# Altium schematic sheet isolator_si8662.SchDoc
size A
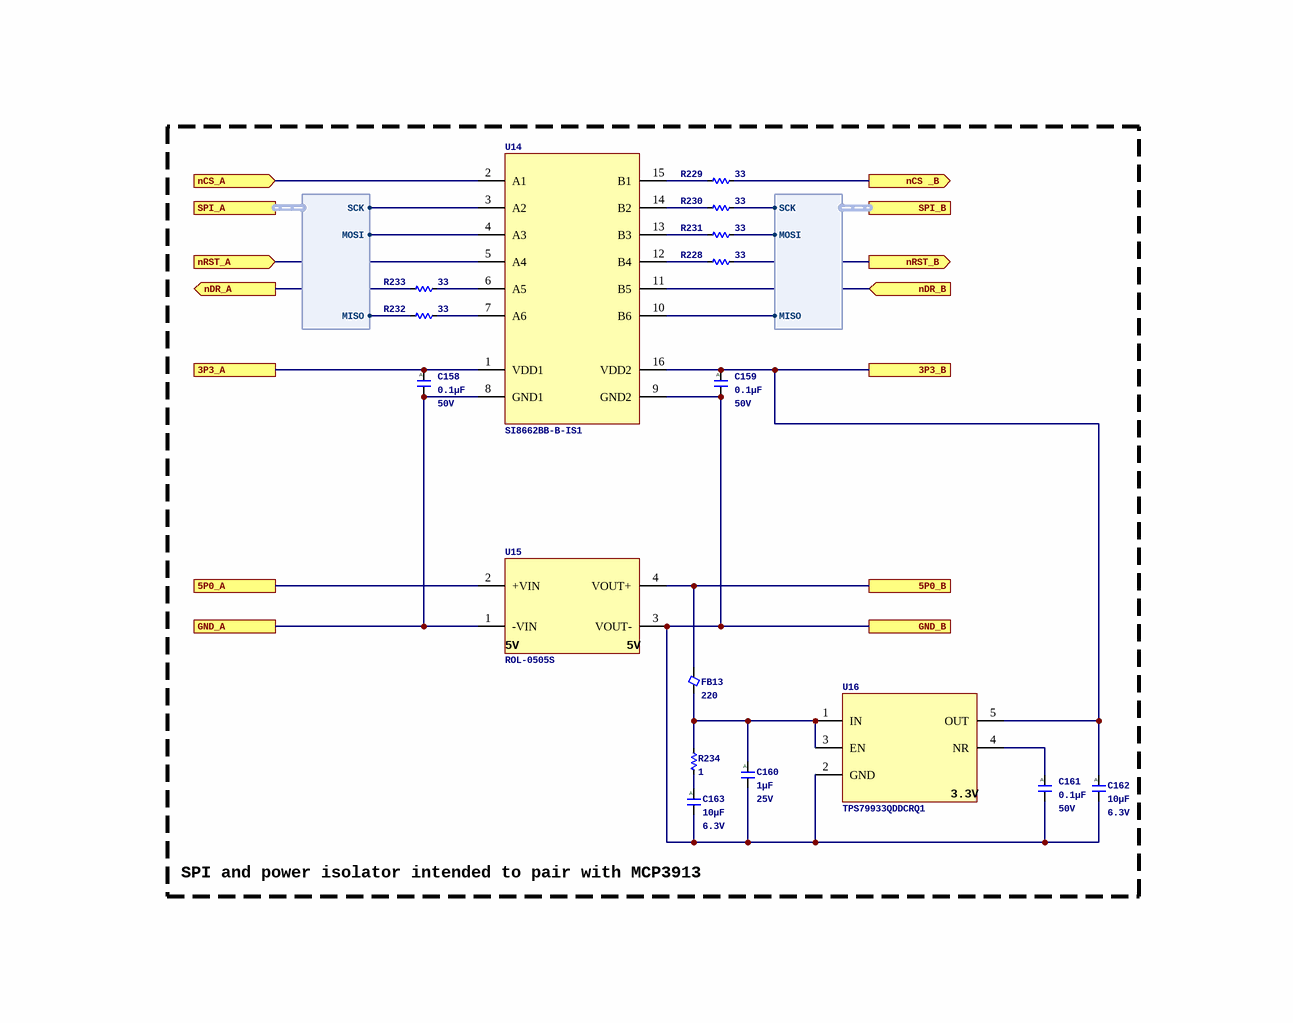
[diagram p0: isolator_si8662.SchDoc]

## Parts
C158  Capacitance: 0.1µF  Voltage - Rated: 50V  [C0402_0.55MM]  (hidden comment: CGA2B3X7R1H104M050BB)
C159  Capacitance: 0.1µF  Voltage - Rated: 50V  [C0402_0.55MM]  (hidden comment: CGA2B3X7R1H104M050BB)
C160  Capacitance: 1µF  Voltage - Rated: 25V  [C0603_0.80MM]  (hidden comment: CGJ3E1X7R1E105K080AC)
C161  Capacitance: 0.1µF  Voltage - Rated: 50V  [C0402_0.55MM]  (hidden comment: CGA2B3X7R1H104M050BB)
C162  Capacitance: 10µF  Voltage - Rated: 6.3V  [C0805_1.45MM]  (hidden comment: CGA4J1X7R0J106M125AC)
C163  Capacitance: 10µF  Voltage - Rated: 6.3V  [C0805_1.45MM]  (hidden comment: CGA4J1X7R0J106M125AC)
FB13  Impedance (Ohms @ 100MHz): 220  [FB0402_0.55MM]  (hidden comment: MPZ1005S221ET000)
R228  Resistance: 33  [R0402_0.40MM]  (hidden comment: ERJ-2RKF33R0X)
R229  Resistance: 33  [R0402_0.40MM]  (hidden comment: ERJ-2RKF33R0X)
R230  Resistance: 33  [R0402_0.40MM]  (hidden comment: ERJ-2RKF33R0X)
R231  Resistance: 33  [R0402_0.40MM]  (hidden comment: ERJ-2RKF33R0X)
R232  Resistance: 33  [R0402_0.40MM]  (hidden comment: ERJ-2RKF33R0X)
R233  Resistance: 33  [R0402_0.40MM]  (hidden comment: ERJ-2RKF33R0X)
R234  Resistance: 1  [R0402_0.40MM]  (hidden comment: ERJ-2BQF1R0X)
U14  SI8662BB-B-IS1  [16SOIC150]
U15  ROL-0505S  [4SIP]
U16  TPS79933QDDCRQ1  [5SOT23]

## Blocks framed on the sheet
SPI and power isolator intended to pair with MCP3913: C158-C163 FB13 R228-R234 U14-U16

## Ports
3P3_A, 3P3_B, 5P0_A, 5P0_B, GND_A, GND_B, nCS _B (out), nCS_A (in), nDR_A (out), nDR_B (in), nRST_A (in), nRST_B (out), SPI_A (harness SPI), SPI_B (harness SPI)

## Harnesses
SPI: MISO, MOSI, SCK

## Nets
3P3_A: C158.1 U14.1(VDD1) ; port 3P3_A
3P3_B: C159.1 C162.1 U14.16(VDD2) U16.5(OUT) ; port 3P3_B
5P0_A: U15.2(+VIN) ; port 5P0_A
5P0_B: FB13.2 U15.4(VOUT+) ; port 5P0_B
GND_A: C158.2 U14.8(GND1) U15.1(-VIN) ; port GND_A
GND_B: C159.2 C160.2 C161.2 C162.2 C163.2 U14.9(GND2) U15.3(VOUT-) U16.2(GND) ; port GND_B
nCS _B: R229.1 ; port nCS _B
nCS_A: U14.2(A1) ; port nCS_A
nDR_A: R233.2 ; port nDR_A
nDR_B: U14.11(B5) ; port nDR_B
nRST_A: U14.5(A4) ; port nRST_A
nRST_B: R228.1 ; port nRST_B
NetC160_1: C160.1 FB13.1 R234.2 U16.1(IN) U16.3(EN)
NetC161_1: C161.1 U16.4(NR)
NetC163_1: C163.1 R234.1
NetR228_2: R228.2 U14.12(B4)
NetR229_2: R229.2 U14.15(B1)
NetR230_1: R230.1 ; port SPI_B.SCK
NetR230_2: R230.2 U14.14(B2)
NetR231_1: R231.1 ; port SPI_B.MOSI
NetR231_2: R231.2 U14.13(B3)
NetR232_1: R232.1 U14.7(A6)
NetR232_2: R232.2 ; port SPI_A.MISO
NetR233_1: R233.1 U14.6(A5)
NetU14_3: U14.3(A2) ; port SPI_A.SCK
NetU14_4: U14.4(A3) ; port SPI_A.MOSI
NetU14_10: U14.10(B6) ; port SPI_B.MISO

## Notes on the sheet
- (in symbol CGA2B3X7R1H104M050BB) A
- (in symbol CGA4J1X7R0J106M125AC) A
- (in symbol CGJ3E1X7R1E105K080AC) A
- (in symbol CONV_DCDC_5V_0.5W_ROL-0505S) 5V
- (in symbol LDO_TPS79933QDDCRQ1) 3.3V

## Library data of the parts
C158 C159 C161 = CGA2B3X7R1H104M050BB: CAP CER 0.1UF 50V X7R 0402; Manufacturer: TDK Corporation; Unit Price (USD): 0.17; Tolerance: ±20%; ComponentLink1URL: https://product.tdk.com/info/en/catalog/datasheets/mlcc_automotive_general_en.pdf?ref_disty=digikey; ComponentLink1Description: Series Datasheet; Series: CGA; Part Status: Active; Temperature Coefficient: X7R; Operating Temperature: -55°C ~ 125°C; Applications: AEC-Q200; Mounting Type: Surface Mount, MLCC; Package / Case: 0402 (1005 Metric); Size / Dimension: 0.039" L x 0.020" W (1.00mm x 0.50mm); Thickness (Max): 0.022" (0.55mm); Supplier 1: Digikey; Supplier Part Number 1: 445-12271-1-ND; Manufacturer Part Number: CGA2B3X7R1H104M050BB
C160 = CGJ3E1X7R1E105K080AC: CAP CER 1UF 25V X7R 0603; Manufacturer: TDK Corporation; Unit Price (USD): 0.55; Tolerance: ±10%; ComponentLink1URL: https://product.tdk.com/info/en/catalog/datasheets/mlcc_highreliability_general_en.pdf?ref_disty=digikey; ComponentLink1Description: Series Datasheet; Series: CGJ; Part Status: Active; Temperature Coefficient: X7R; Operating Temperature: -55°C ~ 125°C; Applications: AEC-Q200; Mounting Type: Surface Mount, MLCC; Package / Case: 0603 (1608 Metric); Size / Dimension: 0.063" L x 0.031" W (1.60mm x 0.80mm); Thickness (Max): 0.031" (0.80mm); Supplier 1: Digikey; Supplier Part Number 1: 445-13311-1-ND; Manufacturer Part Number: CGJ3E1X7R1E105K080AC
C162 C163 = CGA4J1X7R0J106M125AC: CAP CER 10UF 6.3V X7R 0805; Manufacturer: TDK Corporation; Unit Price (USD): 0.43; Tolerance: ±20%; ComponentLink1URL: https://product.tdk.com/info/en/catalog/datasheets/mlcc_automotive_general_en.pdf?ref_disty=digikey; ComponentLink1Description: Series Datasheet; Series: CGA; Part Status: Active; Temperature Coefficient: X7R; Operating Temperature: -55°C ~ 125°C; Applications: AEC-Q200; Mounting Type: Surface Mount, MLCC; Package / Case: 0805 (2012 Metric); Size / Dimension: 0.079" L x 0.049" W (2.00mm x 1.25mm); Thickness (Max): 0.057" (1.45mm); Supplier 1: Digikey; Supplier Part Number 1: 445-12776-1-ND; Manufacturer Part Number: CGA4J1X7R0J106M125AC
FB13 = MPZ1005S221ET000: FERRITE BEAD 220 OHM 0402 1LN; Manufacturer: TDK Corporation; Filter Type: Power Line; Current Rating (Max): 900mA; DC Resistance (DCR) (Max): 220mOhm; ComponentLink1URL: https://product.tdk.com/info/en/catalog/datasheets/beads_commercial_power_mpz1005-e_en.pdf; ComponentLink1Description: Datasheet; Series: MPZ-E; Part Status: Active; Operating Temperature: -55°C ~ 125°C; Package / Case: 0402 (1005 Metric); Mounting Type: Surface Mount; Height (Max): 0.022" (0.55mm); Size / Dimension: 0.039" L x 0.020" W (1.00mm x 0.50mm); Supplier Part Number 1: 445-9329-1-ND; Supplier 1: Digikey; Manufacturer Part Number: MPZ1005S221ET000; Supplier 2: LCSC; Supplier Part Number 2: C165811
R228-R233 = ERJ-2RKF33R0X: RES SMD 33 OHM 1% 1/10W 0402; Manufacturer: Panasonic Electronic Components; Unit Price (USD): 0.1; Power (Watts): 0.1W, 1/10W; Temperature Coefficient: ±100ppm/°C; ComponentLink1Description: Datasheet; ComponentLink1URL: https://industrial.panasonic.com/cdbs/www-data/pdf/RDA0000/AOA0000C304.pdf; Series: ERJ; Tolerance: ±1%; Composition: Thick Film; Features: Automotive AEC-Q200; Operating Temperature: -55°C ~ 155°C; Package / Case: 0402 (1005 Metric); Supplier Device Package: 0402; Size / Dimension: 0.039" L x 0.020" W (1.00mm x 0.50mm); Height - Seated (Max): 0.016" (0.40mm); Supplier 1: Digikey; Supplier Part Number 1: P33.0LCT-ND; Manufacturer Part Number: ERJ-2RKF33R0X
R234 = ERJ-2BQF1R0X: RES SMD 1 OHM 1% 1/6W 0402; Manufacturer: Panasonic Electronic Components; Unit Price (USD): 0.41; Power (Watts): 0.167W, 1/6W; Temperature Coefficient: ±250ppm/°C; ComponentLink1Description: Datasheet; ComponentLink1URL: https://industrial.panasonic.com/cdbs/www-data/pdf/RDN0000/AOA0000C313.pdf; Series: ERJ; Tolerance: ±1%; Composition: Thick Film; Features: Automotive AEC-Q200, Current Sense; Operating Temperature: -55°C ~ 125°C; Package / Case: 0402 (1005 Metric); Supplier Device Package: 0402; Size / Dimension: 0.039" L x 0.020" W (1.00mm x 0.50mm); Height - Seated (Max): 0.016" (0.40mm); Supplier 1: Digikey; Supplier Part Number 1: P17252CT-ND; Manufacturer Part Number: ERJ-2BQF1R0X
U14 = ISO_SI8662BB-B-IS1: 6-ch 2.5kV Isolator, 150M, 4/2, NB SOIC16, lead free; Manufacturer: Skyworks Solutions; Supplier 1: Digikey; Supplier Part Number 1: SI8662BB-B-IS1-ND; Manufacturer Part Number: SI8662BB-B-IS1; Supplier 2: LCSC; Supplier Part Number 2: C430287; ComponentLink1Description: Datasheet; ComponentLink1URL: https://www.skyworksinc.com/-/media/Skyworks/SL/documents/public/data-sheets/Si866x.pdf
U15 = CONV_DCDC_5V_0.5W_ROL-0505S: 5V to 5V isolated power supply module; Manufacturer: Recom; Parameter 1: LCSC; Parameter 2: C22372006; Supplier 1: Digikey; Supplier Part Number 1: 945-1949-5-ND; Manufacturer Part Number: ROL-0505S; ComponentLink1Description: Datasheet; ComponentLink1URL: https://recom-power.com/pdf/Econoline/ROL.pdf
U16 = LDO_TPS79933QDDCRQ1: Fixed Positive LDO Regulator, 3.3V, 0.16V Dropout, BICMOS, PDSO5; Manufacturer: Texas Instruments; Supplier 1: Digikey; Supplier Part Number 1: 296-24852-1-ND; Manufacturer Part Number: TPS79933QDDCRQ1; RoHS Compliant: Yes; ComponentLink1Description: Datasheet; ComponentLink1URL: https://www.ti.com/lit/ds/symlink/tps799-q1.pdf; Supplier 2: LCSC; Supplier Part Number 2: C2865613